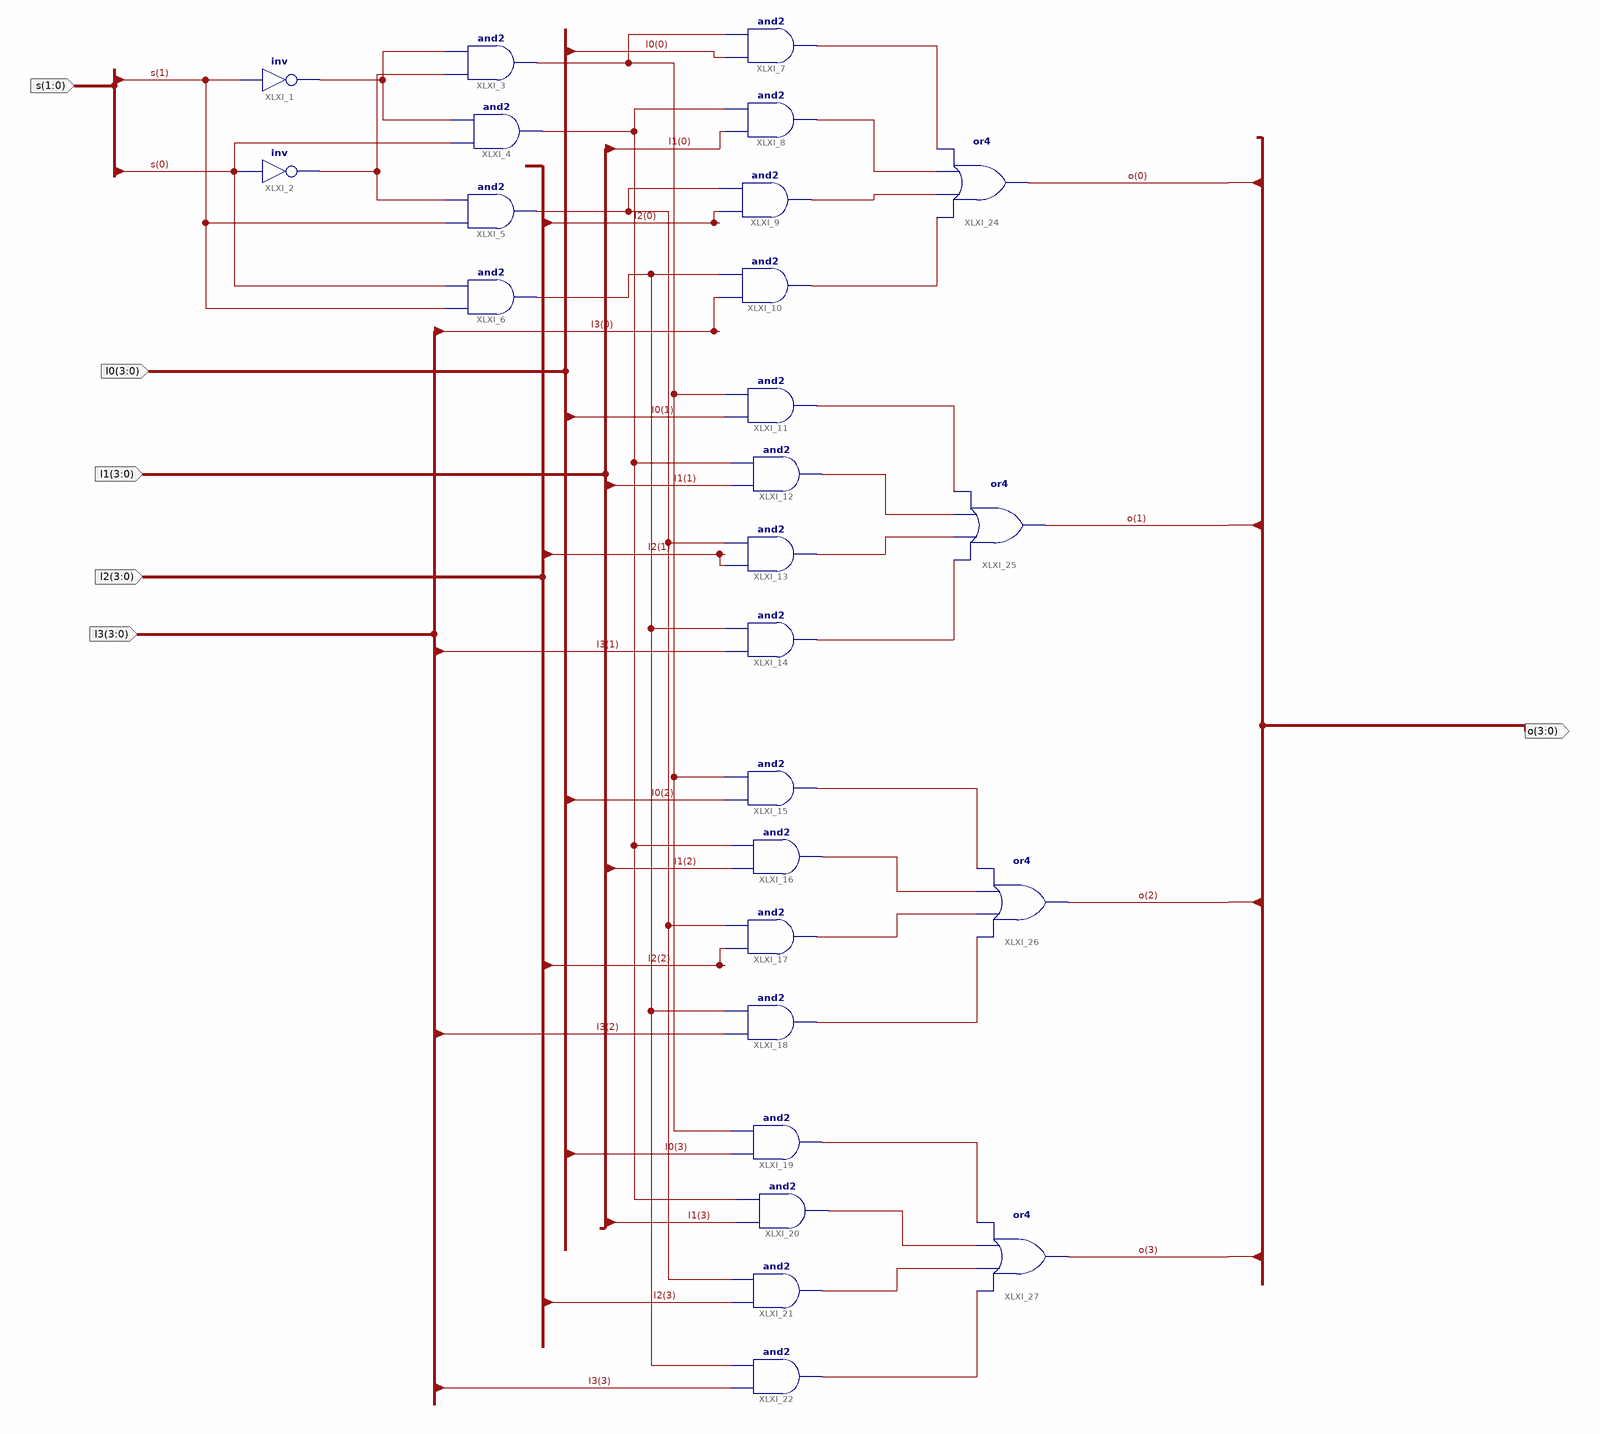
[diagram p0: schematic sheet 1]
// Xilinx ISE schematic Mux4to1b4.sch (kintex7) as structural Verilog: 26 symbols, 6 ports
module Mux4to1b4 (
  input  [3:0] I0,
  input  [3:0] I1,
  input  [3:0] I2,
  input  [3:0] I3,
  input  [1:0] s,
  output [3:0] o
);

  wire XLXN_2, XLXN_11, XLXN_13, XLXN_14, XLXN_15, XLXN_53, XLXN_63, XLXN_65, XLXN_66, XLXN_67, XLXN_69,
       XLXN_70, XLXN_71, XLXN_72, XLXN_73, XLXN_74, XLXN_75, XLXN_76, XLXN_77, XLXN_78, XLXN_79, XLXN_80;

  not XLXI_1 (XLXN_2, s[1]);
  not XLXI_2 (XLXN_11, s[0]);
  and XLXI_3 (XLXN_13, XLXN_11, XLXN_2);
  and XLXI_4 (XLXN_14, s[0], XLXN_2);
  and XLXI_5 (XLXN_15, s[1], XLXN_11);
  and XLXI_6 (XLXN_53, s[1], s[0]);
  and XLXI_7 (XLXN_63, I0[0], XLXN_13);
  and XLXI_8 (XLXN_65, I1[0], XLXN_14);
  and XLXI_9 (XLXN_66, I2[0], XLXN_15);
  and XLXI_10 (XLXN_67, I3[0], XLXN_53);
  and XLXI_11 (XLXN_69, I0[1], XLXN_13);
  and XLXI_12 (XLXN_70, I1[1], XLXN_14);
  and XLXI_13 (XLXN_71, I2[1], XLXN_15);
  and XLXI_14 (XLXN_72, I3[1], XLXN_53);
  and XLXI_15 (XLXN_73, I0[2], XLXN_13);
  and XLXI_16 (XLXN_74, I1[2], XLXN_14);
  and XLXI_17 (XLXN_75, I2[2], XLXN_15);
  and XLXI_18 (XLXN_76, I3[2], XLXN_53);
  and XLXI_19 (XLXN_77, I0[3], XLXN_13);
  and XLXI_20 (XLXN_78, I1[3], XLXN_14);
  and XLXI_21 (XLXN_79, I2[3], XLXN_15);
  and XLXI_22 (XLXN_80, I3[3], XLXN_53);
  or XLXI_24 (o[0], XLXN_67, XLXN_66, XLXN_65, XLXN_63);
  or XLXI_25 (o[1], XLXN_72, XLXN_71, XLXN_70, XLXN_69);
  or XLXI_26 (o[2], XLXN_76, XLXN_75, XLXN_74, XLXN_73);
  or XLXI_27 (o[3], XLXN_80, XLXN_79, XLXN_78, XLXN_77);
endmodule
